# EasyEDA Pro project luoye-recorder-pcb-2026-07-16.epro, schematic MIC
Create Date: 2026-06-14; Page Name: P1; Project Name: AI RECORD; Schematic Name: MIC; Update Date: 2026-06-20; Company: 嘉立创EDA; Page Size: A; Version: V1.0
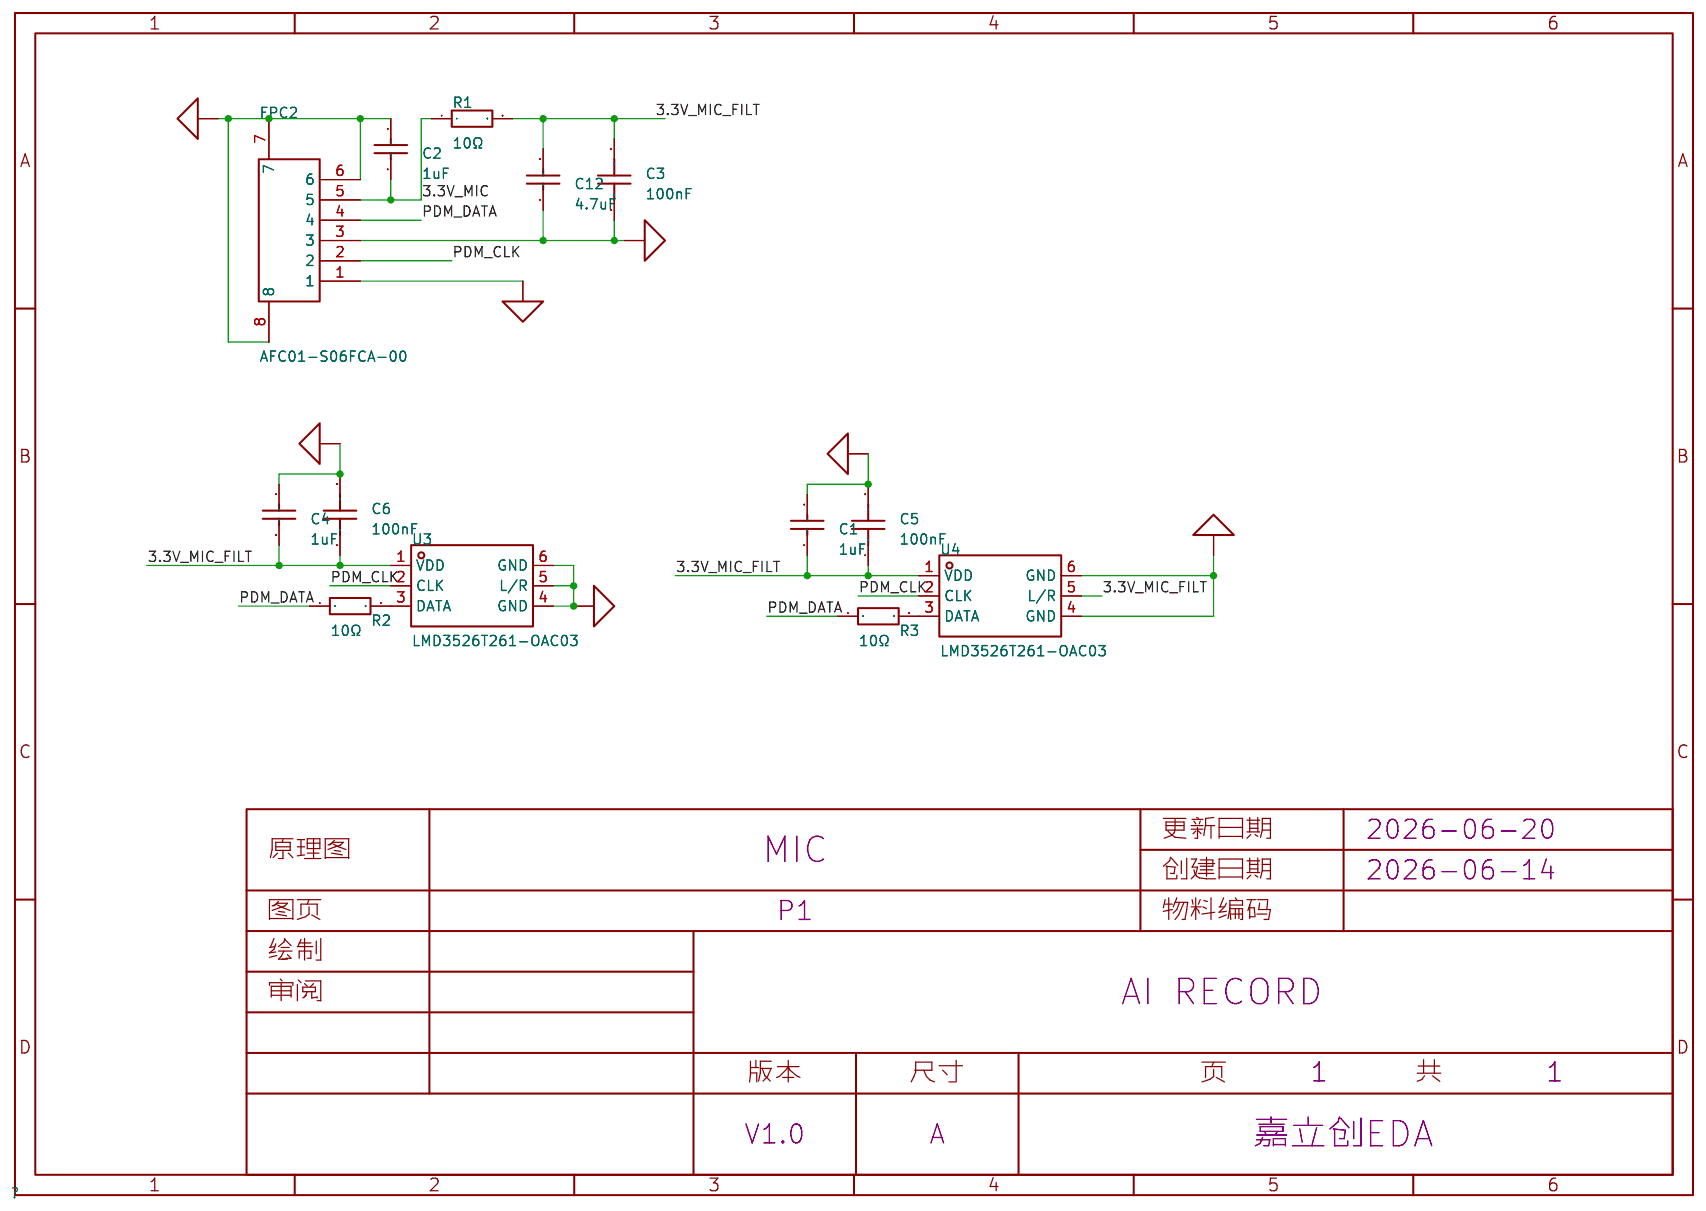
[diagram p1: schematic sheet]

## Parts
C1  1uF  [C0402]
C2  1uF  [C0402]
C3  100nF  [C0402]
C4  1uF  [C0402]
C5  100nF  [C0402]
C6  100nF  [C0402]
C12  4.7uF  [C0805]
FPC2  AFC01-S06FCA-00  [FPC-SMD_P0.50-6P_AFC01-S06FCA-00]
R1  10Ω  [R0805]
R2  10Ω  [R0805]
R3  10Ω  [R0805]
U3  LMD3526T261-OAC03  [MIC-SMD_6P-L3.5-W2.7-P0.884-TR]
U4  LMD3526T261-OAC03  [MIC-SMD_6P-L3.5-W2.7-P0.884-TR]

## Library data of the parts
C1 C2 C4 = CL05A105KO5NNNC: 容值:1uF;精度:±10%;额定电压:16V;温度系数:X5R;; LCSC Part Name: 1uF ±10% 16V; Supplier Part: C29266; Manufacturer: SAMSUNG(三星); Supplier Footprint: 0402; JLCPCB Part Class: Extended Part; Datasheet: https://item.szlcsc.com/datasheet/CL05A105KO5NNNC/30018.html; Supplier: LCSC; Tolerance: ±10%; Voltage Rating: 16V; Temperature Coefficient: X5R
C3 C5 C6 = CL05B104KO5NNNC: 容值:100nF;精度:±10%;额定电压:16V;温度系数:X7R;; LCSC Part Name: 100nF ±10% 16V; Supplier Part: C1525; Manufacturer: SAMSUNG(三星); Supplier Footprint: 0402; JLCPCB Part Class: Basic Part; Datasheet: https://item.szlcsc.com/datasheet/CL05B104KO5NNNC/1877.html; Supplier: LCSC; Tolerance: ±10%; Voltage Rating: 16V; Temperature Coefficient: X7R
C12 = CL21A475KAQNNNE: 容值:4.7uF;精度:±10%;额定电压:25V;温度系数:X5R;; LCSC Part Name: 4.7uF ±10% 25V; Supplier Part: C1779; Manufacturer: SAMSUNG(三星); Supplier Footprint: 0805; JLCPCB Part Class: Basic Part; Datasheet: https://item.szlcsc.com/datasheet/CL21A475KAQNNNE/2131.html; Supplier: LCSC; Tolerance: ±10%; Voltage Rating: 25V; Temperature Coefficient: X5R
FPC2 = AFC01-S06FCA-00: 锁定特性:翻盖式;触点类型:下接;触点数量:6P;间距:0.5mm;安装类型:卧贴;; LCSC Part Name: 间距:0.5mm P数:6P 翻盖式 下接; Supplier Part: C262655; Manufacturer: JS(钜硕电子); Supplier Footprint: SMD,P=0.5mm,卧贴; JLCPCB Part Class: Extended Part; Datasheet: https://atta.szlcsc.com/upload/public/pdf/source/20190816/C413942_2A72D1AC756EAE17EEDF756A339D4500.pdf; Supplier: LCSC; Locking Feature: 翻盖式; Contact Type: 下接; Number of Contacts: 6P; Pitch: 0.5mm; Mounting Type: 卧贴; FFC, FCB Thickness: 0.3mm; Height Above Board: 2mm
R1-R3 = RC0805FR-0710RL: 电阻类型:厚膜电阻;阻值:10Ω;精度:±1%;功率:125mW;工作电压:150V;温度系数:±200ppm/℃;; LCSC Part Name: 厚膜电阻 10Ω ±1% 125mW; Supplier Part: C96347; Manufacturer: YAGEO(国巨); Supplier Footprint: 0805; JLCPCB Part Class: Extended Part; Datasheet: https://item.szlcsc.com/datasheet/RC0805FR-0710RL/97551.html; Supplier: LCSC; Type: 厚膜电阻; Tolerance: ±1%; Power(Watts): 125mW; Voltage-Supply(Max): 150V; Temperature Coefficient: ±200ppm/℃; Operating Temperature: -55℃~+155℃
U3 U4 = LMD3526T261-OAC03: 方向:全指向;灵敏度:-26dB;; LCSC Part Name: MEMSmic数字硅麦3526 上进音 s-26db±1 snr61db LMD:聆麦数字麦克风/3526:尺寸/T:上进音/261:-26±1dB; Supplier Part: C7587899; Manufacturer: LinkMems(聆麦声学); Supplier Footprint: SMD-6P,3.5x2.7mm; JLCPCB Part Class: Extended Part; Datasheet: https://atta.szlcsc.com/upload/public/pdf/source/20240604/F0735E7E9B0FCDCA92015CC5CA9EAE15.pdf; Supplier: LCSC; Direction: 全指向; Supply Voltage: 1.62V~3.6V; Current Consumption: 750uA; Sensitivity: -26dB

## Nets
3.3V_MIC: C2.2 FPC2.5 R1.1
3.3V_MIC_FILT: C1.1 C3.2 C4.1 C5.1 C6.1 C12.2 R1.2 U3.1(VDD) U4.1(VDD) U4.5(L/R)
AGND: C1.2 C2.1 C3.1 C4.2 C5.2 C6.2 C12.1 FPC2.1 FPC2.3 FPC2.6 FPC2.7 FPC2.8 U3.4(GND) U3.5(L/R) U3.6(GND) U4.4(GND) U4.6(GND)
PDM_CLK: FPC2.2 U3.2(CLK) U4.2(CLK)
PDM_DATA: FPC2.4 R2.1 R3.1
Net-(R2-2): R2.2 U3.3(DATA)
Net-(R3-2): R3.2 U4.3(DATA)
